# Altium schematic sheet ControlBoard.SchDoc
size A4
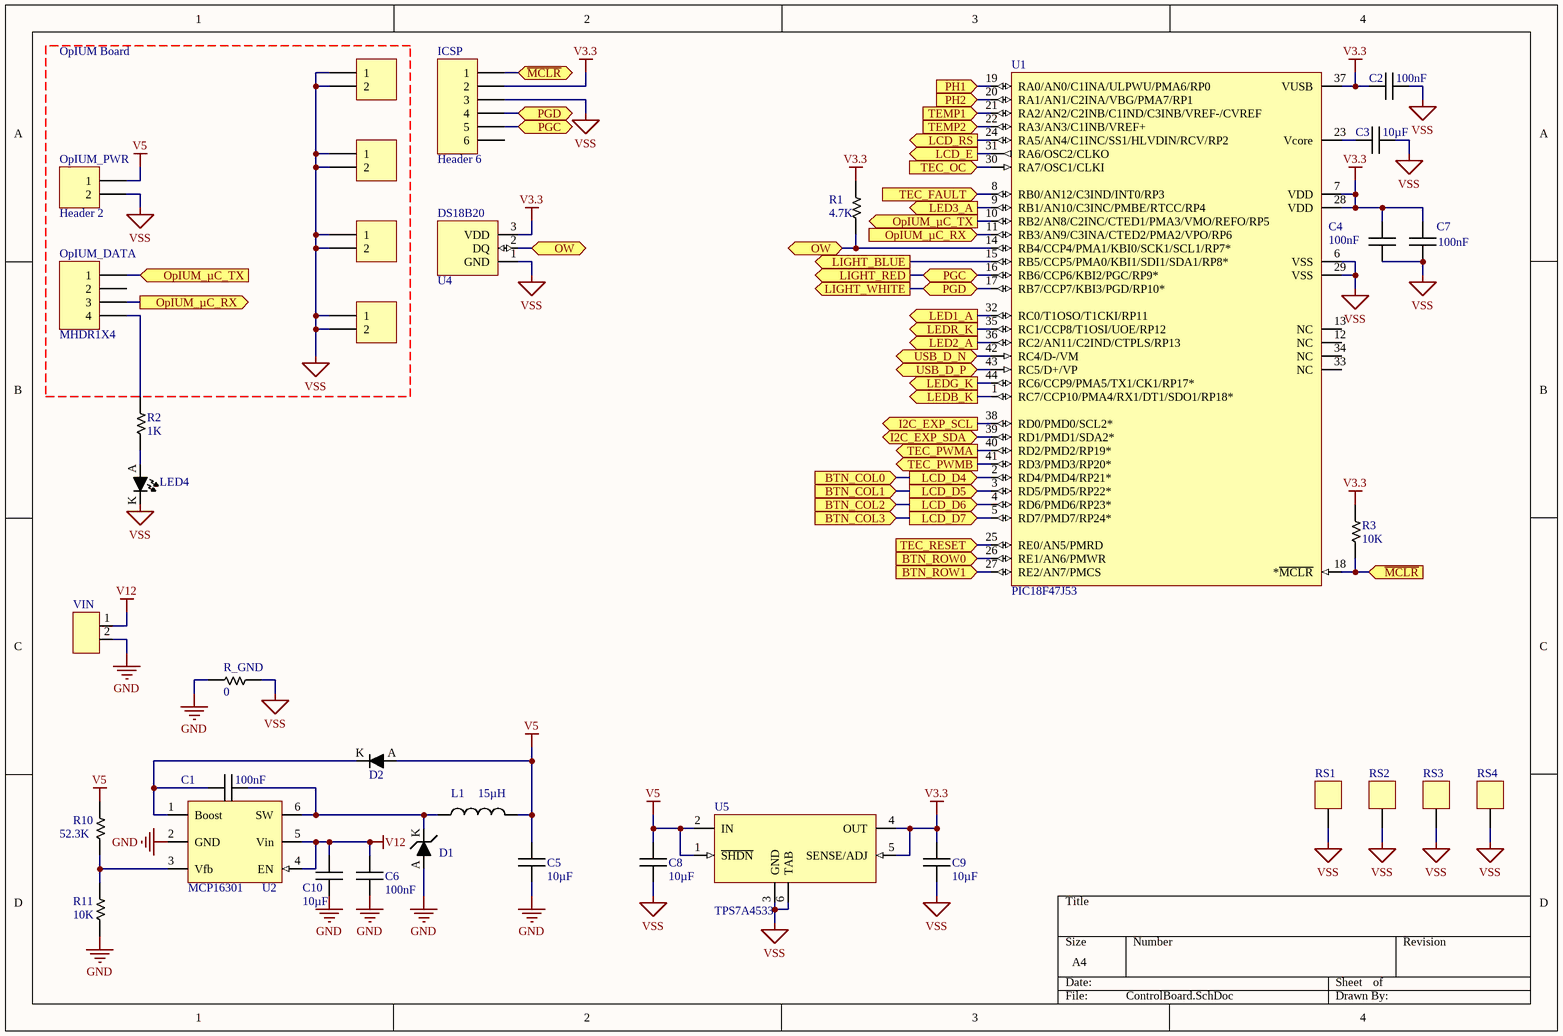
[diagram p0: ControlBoard.SchDoc]

## Parts
C1  100nF  [CAPC1608N]
C2  100nF  [CAPC1608N]
C3  10µF  [CAPC2012N]
C4  100nF  [CAPC1608N]
C5  10µF  [CAPC2012N]
C6  100nF  [CAPC1608N]
C7  100nF  [CAPC1608N]
C8  10µF  [CAPC2012N]
C9  10µF  [CAPC2012N]
C10  10µF  [CAPC3225N]
D1  Schottky Diode  [DO-214AC]  (value not drawn)
D2  Diode  [SOT323]  (value not drawn)
ICSP  Header 6  [HDR1X6]
L1  15µH  [INDUCTOR 6×6mm Taiyo Yuden]
LED4  (no value)  [LED 1608m]
OpIUM_DATA  MHDR1X4  [MHDR1X4]
OpIUM_PWR  Header 2  [HDR1X2]
R1  4.7K  [RESC1608N]
R2  1K  [RESC1608N]
R3  10K  [RESC1608N]
R10  52.3K  [RESC1608N]
R11  10K  [RESC1608N]
R_GND  0  [RESC1608N]
RS1  PCB Riser  [PCB Riser 6×10mm 3mm]  (value not drawn)
RS2  PCB Riser  [PCB Riser 6×10mm 3mm]  (value not drawn)
RS3  PCB Riser  [PCB Riser 6×10mm 3mm]  (value not drawn)
RS4  PCB Riser  [PCB Riser 6×10mm 3mm]  (value not drawn)
SUPPORT1  MHDR1X2  [MHDR1X2]  (value not drawn)
SUPPORT2  MHDR1X2  [MHDR1X2]  (value not drawn)
SUPPORT3  MHDR1X2  [MHDR1X2]  (value not drawn)
SUPPORT4  MHDR1X2  [MHDR1X2]  (value not drawn)
U1  PIC18F47J53  [TQFP-PT44_N]
U2  MCP16301  [SOT23-6_N]
U4  DS18B20  [TO-92A]
U5  TPS7A4533  [SOT223-6N]
VIN  High-Power Connector 2p  [High-Power Connector 2]  (value not drawn)

## Ports
BTN_COL0 (in), BTN_COL1 (in), BTN_COL2 (in), BTN_COL3 (in), BTN_ROW0 (in), BTN_ROW1 (in), I2C_EXP_SCL (out), I2C_EXP_SDA (bidir), LCD_D4 (out), LCD_D5 (out), LCD_D6 (out), LCD_D7 (out), LCD_E (out), LCD_RS (out), LED1_A (out), LED2_A (out), LED3_A (out), LEDB_K (out), LEDG_K (out), LEDR_K (out), LIGHT_BLUE (out), LIGHT_RED (out), LIGHT_WHITE (out), OpIUM_µC_RX (in), OpIUM_µC_RX (out), OpIUM_µC_TX (in), OpIUM_µC_TX (out), OW (bidir), PGC (bidir), PGD (bidir), PH1 (in), PH2 (in), TEC_FAULT (in), TEC_OC (in), TEC_PWMA (out), TEC_PWMB (out), TEC_RESET (in), TEMP1 (in), TEMP2 (in), USB_D_N (bidir), USB_D_P (bidir), ~{MCLR} (bidir), ~{MCLR} (in)

## Nets
GND: C5.1 C6.2 C10.1 D1.A(Anode) R11.1 R_GND.1 U2.2(GND) VIN.2
V3.3: C2.2 C4.2 C7.2 C9.2 ICSP.2 R1.2 R3.2 U1.7(VDD) U1.28(VDD) U1.37(VUSB) U4.3(VDD) U5.4(OUT) U5.5(SENSE/ADJ)
V5: C5.2 C8.2 D2.A L1.2 OpIUM_PWR.1 R10.2 U5.1(~{SHDN}) U5.2(IN)
V12: C6.1 C10.2 U2.4(EN) U2.5(Vin) VIN.1
VSS: C2.1 C3.1 C4.1 C7.1 C8.1 C9.1 ICSP.3 LED4.K OpIUM_PWR.2 R_GND.2 RS1.1 RS2.1 RS3.1 RS4.1 SUPPORT1.1 SUPPORT1.2 SUPPORT2.1 SUPPORT2.2 SUPPORT3.1 SUPPORT3.2 SUPPORT4.1 SUPPORT4.2 U1.6(VSS) U1.29(VSS) U4.1(GND) U5.3(GND) U5.6(TAB)
BTN_COL0: U1.2(RD4/PMD4/RP21*) ; port LCD_D4, port BTN_COL0
BTN_COL1: U1.3(RD5/PMD5/RP22*) ; port LCD_D5, port BTN_COL1
BTN_COL2: U1.4(RD6/PMD6/RP23*) ; port LCD_D6, port BTN_COL2
BTN_COL3: U1.5(RD7/PMD7/RP24*) ; port LCD_D7, port BTN_COL3
BTN_ROW0: U1.26(RE1/AN6/PMWR) ; port BTN_ROW0
BTN_ROW1: U1.27(RE2/AN7/PMCS) ; port BTN_ROW1
I2C_EXP_SCL: U1.38(RD0/PMD0/SCL2*) ; port I2C_EXP_SCL
I2C_EXP_SDA: U1.39(RD1/PMD1/SDA2*) ; port I2C_EXP_SDA
LCD_E: U1.31(RA6/OSC2/CLKO) ; port LCD_E
LCD_RS: U1.24(RA5/AN4/C1INC/SS1/HLVDIN/RCV/RP2) ; port LCD_RS
LED1_A: U1.32(RC0/T1OSO/T1CKI/RP11) ; port LED1_A
LED2_A: U1.36(RC2/AN11/C2IND/CTPLS/RP13) ; port LED2_A
LED3_A: U1.9(RB1/AN10/C3INC/PMBE/RTCC/RP4) ; port LED3_A
LEDB_K: U1.1(RC7/CCP10/PMA4/RX1/DT1/SDO1/RP18*) ; port LEDB_K
LEDG_K: U1.44(RC6/CCP9/PMA5/TX1/CK1/RP17*) ; port LEDG_K
LEDR_K: U1.35(RC1/CCP8/T1OSI/UOE/RP12) ; port LEDR_K
LIGHT_BLUE: U1.15(RB5/CCP5/PMA0/KBI1/SDI1/SDA1/RP8*) ; port LIGHT_BLUE
LIGHT_RED: ICSP.5 U1.16(RB6/CCP6/KBI2/PGC/RP9*) ; port PGC, port LIGHT_RED
LIGHT_WHITE: ICSP.4 U1.17(RB7/CCP7/KBI3/PGD/RP10*) ; port PGD, port LIGHT_WHITE
~{MCLR}: ICSP.1 R3.1 U1.18(*~{MCLR}) ; port ~{MCLR}
OpIUM_µC_RX: OpIUM_DATA.3 U1.11(RB3/AN9/C3INA/CTED2/PMA2/VPO/RP6) ; port OpIUM_µC_RX
OpIUM_µC_TX: OpIUM_DATA.1 U1.10(RB2/AN8/C2INC/CTED1/PMA3/VMO/REFO/RP5) ; port OpIUM_µC_TX
OW: R1.1 U1.14(RB4/CCP4/PMA1/KBI0/SCK1/SCL1/RP7*) U4.2(DQ) ; port OW
PH1: U1.19(RA0/AN0/C1INA/ULPWU/PMA6/RP0) ; port PH1
PH2: U1.20(RA1/AN1/C2INA/VBG/PMA7/RP1) ; port PH2
TEC_FAULT: U1.8(RB0/AN12/C3IND/INT0/RP3) ; port TEC_FAULT
TEC_OC: U1.30(RA7/OSC1/CLKI) ; port TEC_OC
TEC_PWMA: U1.40(RD2/PMD2/RP19*) ; port TEC_PWMA
TEC_PWMB: U1.41(RD3/PMD3/RP20*) ; port TEC_PWMB
TEC_RESET: U1.25(RE0/AN5/PMRD) ; port TEC_RESET
TEMP1: U1.21(RA2/AN2/C2INB/C1IND/C3INB/VREF-/CVREF) ; port TEMP1
TEMP2: U1.22(RA3/AN3/C1INB/VREF+) ; port TEMP2
USB_D_N: U1.42(RC4/D-/VM) ; port USB_D_N
USB_D_P: U1.43(RC5/D+/VP) ; port USB_D_P
NetC1_1: C1.1 D1.K(Kathode) L1.1 U2.6(SW)
NetC1_2: C1.2 D2.K U2.1(Boost)
NetC3_2: C3.2 U1.23(Vcore)
NetLED4_A: LED4.A R2.1
NetOpIUM_DATA_4: OpIUM_DATA.4 R2.2
NetR10_1: R10.1 R11.2 U2.3(Vfb)

Not connected (* = marked no-connect by the designer): ICSP 6; OpIUM_DATA 2; U1 12(NC) 13(NC) 33(NC) 34(NC)

## Notes on the sheet
- OpIUM Board

## Library data of the parts
C1 C6 = Capacitor: Voltage Rating: 50V; Value: 100nF
C2-C5 C7-C10 = Capacitor
  C2 C4 C7: Value: 100nF
  C3 C5 C8-C10: Value: 10µF
D1 = Schottky Diode: Model: SS14
D2 = Diode: pin to pad: A>1 K>3; Model: M1MA141KT1G
ICSP = Header 6: Header, 6-Pin; LatestRevisionDate: 17-Jul-2002; LatestRevisionNote: Re-released for DXP Platform.; Publisher: Altium Limited
L1 = Inductor: Value: 15µH
LED4 = LED: pin to pad: A>1 K>2
OpIUM_DATA = MHDR1X4: Header, 4-Pin; LatestRevisionDate: 17-Jul-2002; LatestRevisionNote: Re-released for DXP Platform.; Publisher: Altium Limited
OpIUM_PWR = Header 2: Header, 2-Pin; LatestRevisionDate: 17-Jul-2002; LatestRevisionNote: Re-released for DXP Platform.; Publisher: Altium Limited
R1-R3 R10 R11 R_GND = Resistor
  R1: Value: 4.7K
  R2: Value: 1K
  R3 R11: Value: 10K
  R10: Value: 52.3K
  R_GND: Value: 0
SUPPORT1-SUPPORT4 = MHDR1X2: Header, 2-Pin; LatestRevisionDate: 17-Jul-2002; LatestRevisionNote: Re-released for DXP Platform.; Publisher: Altium Limited
U5 = TPS7A45xx: VIN: 5V; VOUT: 3.3V
RS1-RS4 = PCB Riser: Height: 10mm
U2 = MCP16301: Vout: *